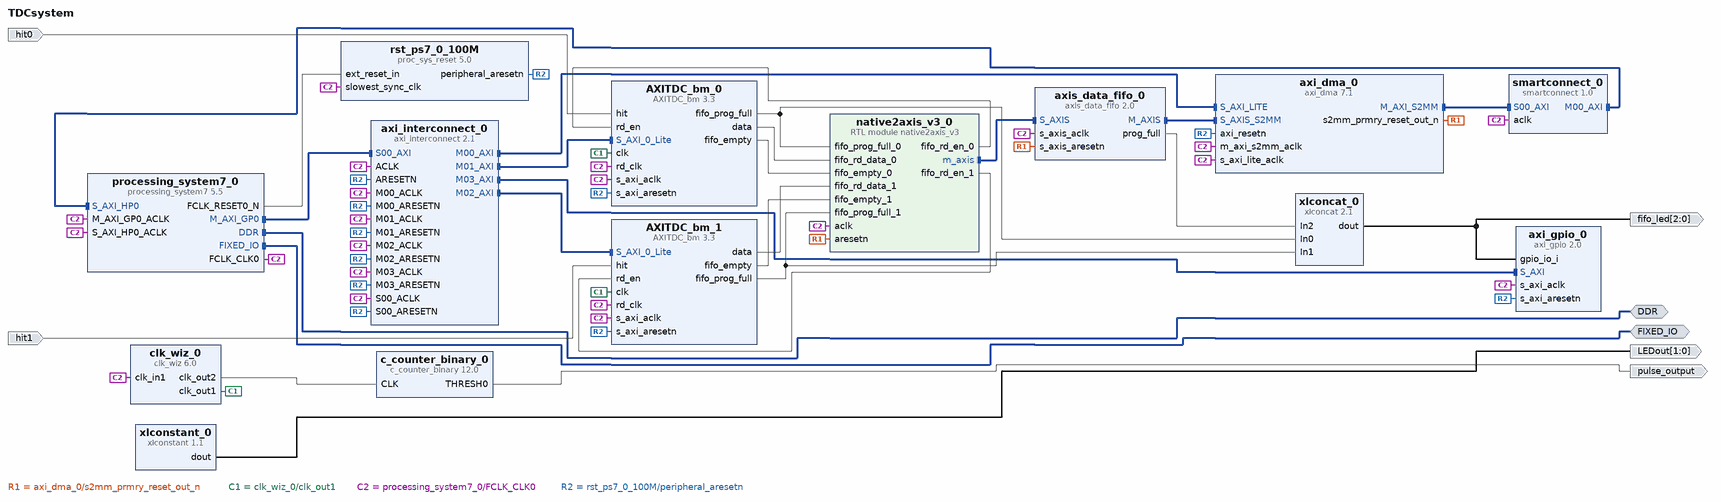
[diagram p0: block diagram of the top level]
# Vivado block design TDCsystem, xc7z010clg400-1, Vivado 2023.2
create_bd_design TDCsystem

create_bd_intf_port -mode Master -vlnv xilinx.com:interface:ddrx_rtl:1.0 DDR
create_bd_intf_port -mode Master -vlnv xilinx.com:display_processing_system7:fixedio_rtl:1.0 FIXED_IO
create_bd_port -dir O -from 1 -to 0 LEDout
create_bd_port -dir O pulse_output
create_bd_port -dir I hit1
create_bd_port -dir I hit0
create_bd_port -dir O -from 2 -to 0 fifo_led

create_bd_cell -type ip -vlnv xilinx.com:ip:clk_wiz:6.0 clk_wiz_0
set_property -dict [list \
  CONFIG.CLKOUT1_JITTER 99.963 \
  CONFIG.CLKOUT1_PHASE_ERROR 94.994 \
  CONFIG.CLKOUT1_REQUESTED_OUT_FREQ 350.000 \
  CONFIG.CLKOUT2_JITTER 163.613 \
  CONFIG.CLKOUT2_PHASE_ERROR 94.994 \
  CONFIG.CLKOUT2_REQUESTED_OUT_FREQ 30.000 \
  CONFIG.CLKOUT2_USED true \
  CONFIG.MMCM_CLKFBOUT_MULT_F 10.500 \
  CONFIG.MMCM_CLKOUT0_DIVIDE_F 3.000 \
  CONFIG.MMCM_CLKOUT1_DIVIDE 35 \
  CONFIG.MMCM_DIVCLK_DIVIDE 1 \
  CONFIG.NUM_OUT_CLKS 2 \
  CONFIG.USE_LOCKED false \
  CONFIG.USE_RESET false \
] [get_bd_cells clk_wiz_0]
create_bd_cell -type ip -vlnv xilinx.com:ip:processing_system7:5.5 processing_system7_0
set_property -dict [list \
  CONFIG.PCW_FPGA0_PERIPHERAL_FREQMHZ 100 \
  CONFIG.PCW_UIPARAM_DDR_FREQ_MHZ 533.333333 \
  CONFIG.PCW_UIPARAM_DDR_MEMORY_TYPE {DDR 3 (Low Voltage)} \
  CONFIG.PCW_UIPARAM_DDR_PARTNO {MT41K256M16 RE-125} \
  CONFIG.PCW_USE_S_AXI_HP0 1 \
] [get_bd_cells processing_system7_0]
# 34 more settings of processing_system7_0 are not shown: defaults, MIO pin electricals, DDR timing, and values the tool derives
create_bd_cell -type ip -vlnv xilinx.com:ip:proc_sys_reset:5.0 rst_ps7_0_100M
create_bd_cell -type ip -vlnv xilinx.com:ip:xlconstant:1.1 xlconstant_0
set_property -dict {CONFIG.CONST_VAL 3 CONFIG.CONST_WIDTH 2} [get_bd_cells xlconstant_0]
create_bd_cell -type ip -vlnv xilinx.com:ip:axi_dma:7.1 axi_dma_0
set_property -dict [list \
  CONFIG.c_include_mm2s 0 \
  CONFIG.c_include_sg 0 \
  CONFIG.c_m_axi_s2mm_data_width 64 \
  CONFIG.c_s2mm_burst_size 256 \
  CONFIG.c_s_axis_s2mm_tdata_width 64 \
  CONFIG.c_sg_length_width 20 \
] [get_bd_cells axi_dma_0]
create_bd_cell -type ip -vlnv xilinx.com:ip:smartconnect:1.0 smartconnect_0
set_property -dict {CONFIG.HAS_ARESETN 0 CONFIG.NUM_SI 1} [get_bd_cells smartconnect_0]
create_bd_cell -type ip -vlnv ustc:user:AXITDC_bm:3.3 AXITDC_bm_0
create_bd_cell -type ip -vlnv ustc:user:AXITDC_bm:3.3 AXITDC_bm_1
create_bd_cell -type ip -vlnv xilinx.com:ip:c_counter_binary:12.0 c_counter_binary_0
set_property -dict [list \
  CONFIG.Output_Width 5 \
  CONFIG.Sync_Threshold_Output true \
  CONFIG.Threshold_Value 1E \
] [get_bd_cells c_counter_binary_0]
create_bd_cell -type ip -vlnv xilinx.com:ip:axi_interconnect:2.1 axi_interconnect_0
set_property -dict {CONFIG.NUM_MI 4} [get_bd_cells axi_interconnect_0]
create_bd_cell -type ip -vlnv xilinx.com:ip:axi_gpio:2.0 axi_gpio_0
set_property -dict [list \
  CONFIG.C_ALL_INPUTS 1 \
  CONFIG.C_GPIO_WIDTH 3 \
  CONFIG.C_IS_DUAL 0 \
  CONFIG.GPIO2_BOARD_INTERFACE Custom \
] [get_bd_cells axi_gpio_0]
create_bd_cell -type ip -vlnv xilinx.com:ip:xlconcat:2.1 xlconcat_0
set_property -dict {CONFIG.NUM_PORTS 3} [get_bd_cells xlconcat_0]
create_bd_cell -type ip -vlnv xilinx.com:ip:axis_data_fifo:2.0 axis_data_fifo_0
set_property -dict [list \
  CONFIG.FIFO_DEPTH 8192 \
  CONFIG.FIFO_MODE 1 \
  CONFIG.HAS_AEMPTY 0 \
  CONFIG.HAS_AFULL 0 \
  CONFIG.HAS_PROG_EMPTY 0 \
  CONFIG.HAS_PROG_FULL 1 \
  CONFIG.HAS_TKEEP 1 \
  CONFIG.HAS_TLAST 1 \
  CONFIG.PROG_FULL_THRESH 4019 \
  CONFIG.TDATA_NUM_BYTES 8 \
] [get_bd_cells axis_data_fifo_0]
create_bd_cell -type module -reference native2axis_v3 native2axis_v3_0

# ---- connections ----

connect_bd_intf_net [get_bd_intf_pins axi_dma_0/M_AXI_S2MM] [get_bd_intf_pins smartconnect_0/S00_AXI]
connect_bd_intf_net [get_bd_intf_pins axi_interconnect_0/M00_AXI] [get_bd_intf_pins axi_dma_0/S_AXI_LITE]
connect_bd_intf_net [get_bd_intf_pins axi_interconnect_0/M01_AXI] [get_bd_intf_pins AXITDC_bm_0/S_AXI_0_Lite]
connect_bd_intf_net [get_bd_intf_pins axi_interconnect_0/M02_AXI] [get_bd_intf_pins AXITDC_bm_1/S_AXI_0_Lite]
connect_bd_intf_net [get_bd_intf_pins axi_interconnect_0/M03_AXI] [get_bd_intf_pins axi_gpio_0/S_AXI]
connect_bd_intf_net [get_bd_intf_pins axi_dma_0/S_AXIS_S2MM] [get_bd_intf_pins axis_data_fifo_0/M_AXIS]
connect_bd_intf_net [get_bd_intf_pins native2axis_v3_0/m_axis] [get_bd_intf_pins axis_data_fifo_0/S_AXIS]
connect_bd_intf_net [get_bd_intf_pins processing_system7_0/DDR] [get_bd_intf_ports DDR]
connect_bd_intf_net [get_bd_intf_pins processing_system7_0/FIXED_IO] [get_bd_intf_ports FIXED_IO]
connect_bd_intf_net [get_bd_intf_pins processing_system7_0/M_AXI_GP0] [get_bd_intf_pins axi_interconnect_0/S00_AXI]
connect_bd_intf_net [get_bd_intf_pins processing_system7_0/S_AXI_HP0] [get_bd_intf_pins smartconnect_0/M00_AXI]
connect_bd_net [get_bd_pins AXITDC_bm_0/data] [get_bd_pins native2axis_v3_0/fifo_rd_data_0]
connect_bd_net [get_bd_pins AXITDC_bm_0/fifo_empty] [get_bd_pins native2axis_v3_0/fifo_empty_0]
connect_bd_net [get_bd_pins AXITDC_bm_0/fifo_prog_full] [get_bd_pins xlconcat_0/In0] [get_bd_pins native2axis_v3_0/fifo_prog_full_0]
connect_bd_net [get_bd_pins AXITDC_bm_1/data] [get_bd_pins native2axis_v3_0/fifo_rd_data_1]
connect_bd_net [get_bd_pins AXITDC_bm_1/fifo_empty] [get_bd_pins native2axis_v3_0/fifo_empty_1]
connect_bd_net [get_bd_pins AXITDC_bm_1/fifo_prog_full] [get_bd_pins xlconcat_0/In1] [get_bd_pins native2axis_v3_0/fifo_prog_full_1]
connect_bd_net [get_bd_pins axi_dma_0/s2mm_prmry_reset_out_n] [get_bd_pins axis_data_fifo_0/s_axis_aresetn] [get_bd_pins native2axis_v3_0/aresetn]
connect_bd_net [get_bd_pins axis_data_fifo_0/prog_full] [get_bd_pins xlconcat_0/In2]
connect_bd_net [get_bd_pins c_counter_binary_0/THRESH0] [get_bd_ports pulse_output]
connect_bd_net [get_bd_pins clk_wiz_0/clk_out1] [get_bd_pins AXITDC_bm_0/clk] [get_bd_pins AXITDC_bm_1/clk]
connect_bd_net [get_bd_pins clk_wiz_0/clk_out2] [get_bd_pins c_counter_binary_0/CLK]
connect_bd_net -net hit0_1 [get_bd_ports hit0] [get_bd_pins AXITDC_bm_0/hit]
connect_bd_net -net hit1_1 [get_bd_ports hit1] [get_bd_pins AXITDC_bm_1/hit]
connect_bd_net [get_bd_pins native2axis_v3_0/fifo_rd_en_0] [get_bd_pins AXITDC_bm_0/rd_en]
connect_bd_net [get_bd_pins native2axis_v3_0/fifo_rd_en_1] [get_bd_pins AXITDC_bm_1/rd_en]
connect_bd_net [get_bd_pins processing_system7_0/FCLK_CLK0] \
  [get_bd_pins processing_system7_0/M_AXI_GP0_ACLK] [get_bd_pins processing_system7_0/S_AXI_HP0_ACLK] \
  [get_bd_pins axi_dma_0/s_axi_lite_aclk] [get_bd_pins axi_dma_0/m_axi_s2mm_aclk] [get_bd_pins clk_wiz_0/clk_in1] \
  [get_bd_pins rst_ps7_0_100M/slowest_sync_clk] [get_bd_pins smartconnect_0/aclk] [get_bd_pins axi_interconnect_0/ACLK] \
  [get_bd_pins axi_interconnect_0/S00_ACLK] [get_bd_pins axi_interconnect_0/M00_ACLK] \
  [get_bd_pins axi_interconnect_0/M01_ACLK] [get_bd_pins axi_interconnect_0/M02_ACLK] [get_bd_pins axi_gpio_0/s_axi_aclk] \
  [get_bd_pins axi_interconnect_0/M03_ACLK] [get_bd_pins axis_data_fifo_0/s_axis_aclk] [get_bd_pins AXITDC_bm_0/s_axi_aclk] \
  [get_bd_pins AXITDC_bm_0/rd_clk] [get_bd_pins AXITDC_bm_1/s_axi_aclk] [get_bd_pins AXITDC_bm_1/rd_clk] \
  [get_bd_pins native2axis_v3_0/aclk]
connect_bd_net [get_bd_pins processing_system7_0/FCLK_RESET0_N] [get_bd_pins rst_ps7_0_100M/ext_reset_in]
connect_bd_net [get_bd_pins rst_ps7_0_100M/peripheral_aresetn] \
  [get_bd_pins axi_dma_0/axi_resetn] [get_bd_pins axi_interconnect_0/S00_ARESETN] \
  [get_bd_pins axi_interconnect_0/M00_ARESETN] [get_bd_pins axi_interconnect_0/ARESETN] \
  [get_bd_pins axi_interconnect_0/M01_ARESETN] [get_bd_pins axi_interconnect_0/M02_ARESETN] \
  [get_bd_pins axi_interconnect_0/M03_ARESETN] [get_bd_pins axi_gpio_0/s_axi_aresetn] [get_bd_pins AXITDC_bm_0/s_axi_aresetn] \
  [get_bd_pins AXITDC_bm_1/s_axi_aresetn]
connect_bd_net [get_bd_pins xlconcat_0/dout] [get_bd_ports fifo_led] [get_bd_pins axi_gpio_0/gpio_io_i]
connect_bd_net [get_bd_pins xlconstant_0/dout] [get_bd_ports LEDout]

# ---- address map ----
assign_bd_address -offset 0x00000000 -range 1G -target_address_space [get_bd_addr_spaces axi_dma_0/Data_S2MM] [get_bd_addr_segs processing_system7_0/S_AXI_HP0/HP0_DDR_LOWOCM]
assign_bd_address -offset 0x40400000 -range 4K -target_address_space [get_bd_addr_spaces processing_system7_0/Data] [get_bd_addr_segs axi_dma_0/S_AXI_LITE/Reg]
assign_bd_address -offset 0x41200000 -range 128 -target_address_space [get_bd_addr_spaces processing_system7_0/Data] [get_bd_addr_segs axi_gpio_0/S_AXI/Reg]
assign_bd_address -offset 0x43C00000 -range 4K -target_address_space [get_bd_addr_spaces processing_system7_0/Data] [get_bd_addr_segs AXITDC_bm_0/s_axi/reg0]
assign_bd_address -offset 0x43C10000 -range 4K -target_address_space [get_bd_addr_spaces processing_system7_0/Data] [get_bd_addr_segs AXITDC_bm_1/s_axi/reg0]

validate_bd_design
save_bd_design
